# EasyEDA schematic SCH_balcony_pump_2022-12-04.json
TITLE: balcony_pump; REV: 1.0; Date: 2022-12-04; Sheet: 1/1; Drawn By: Przemysław Szyszkiewicz; Company: Your Company
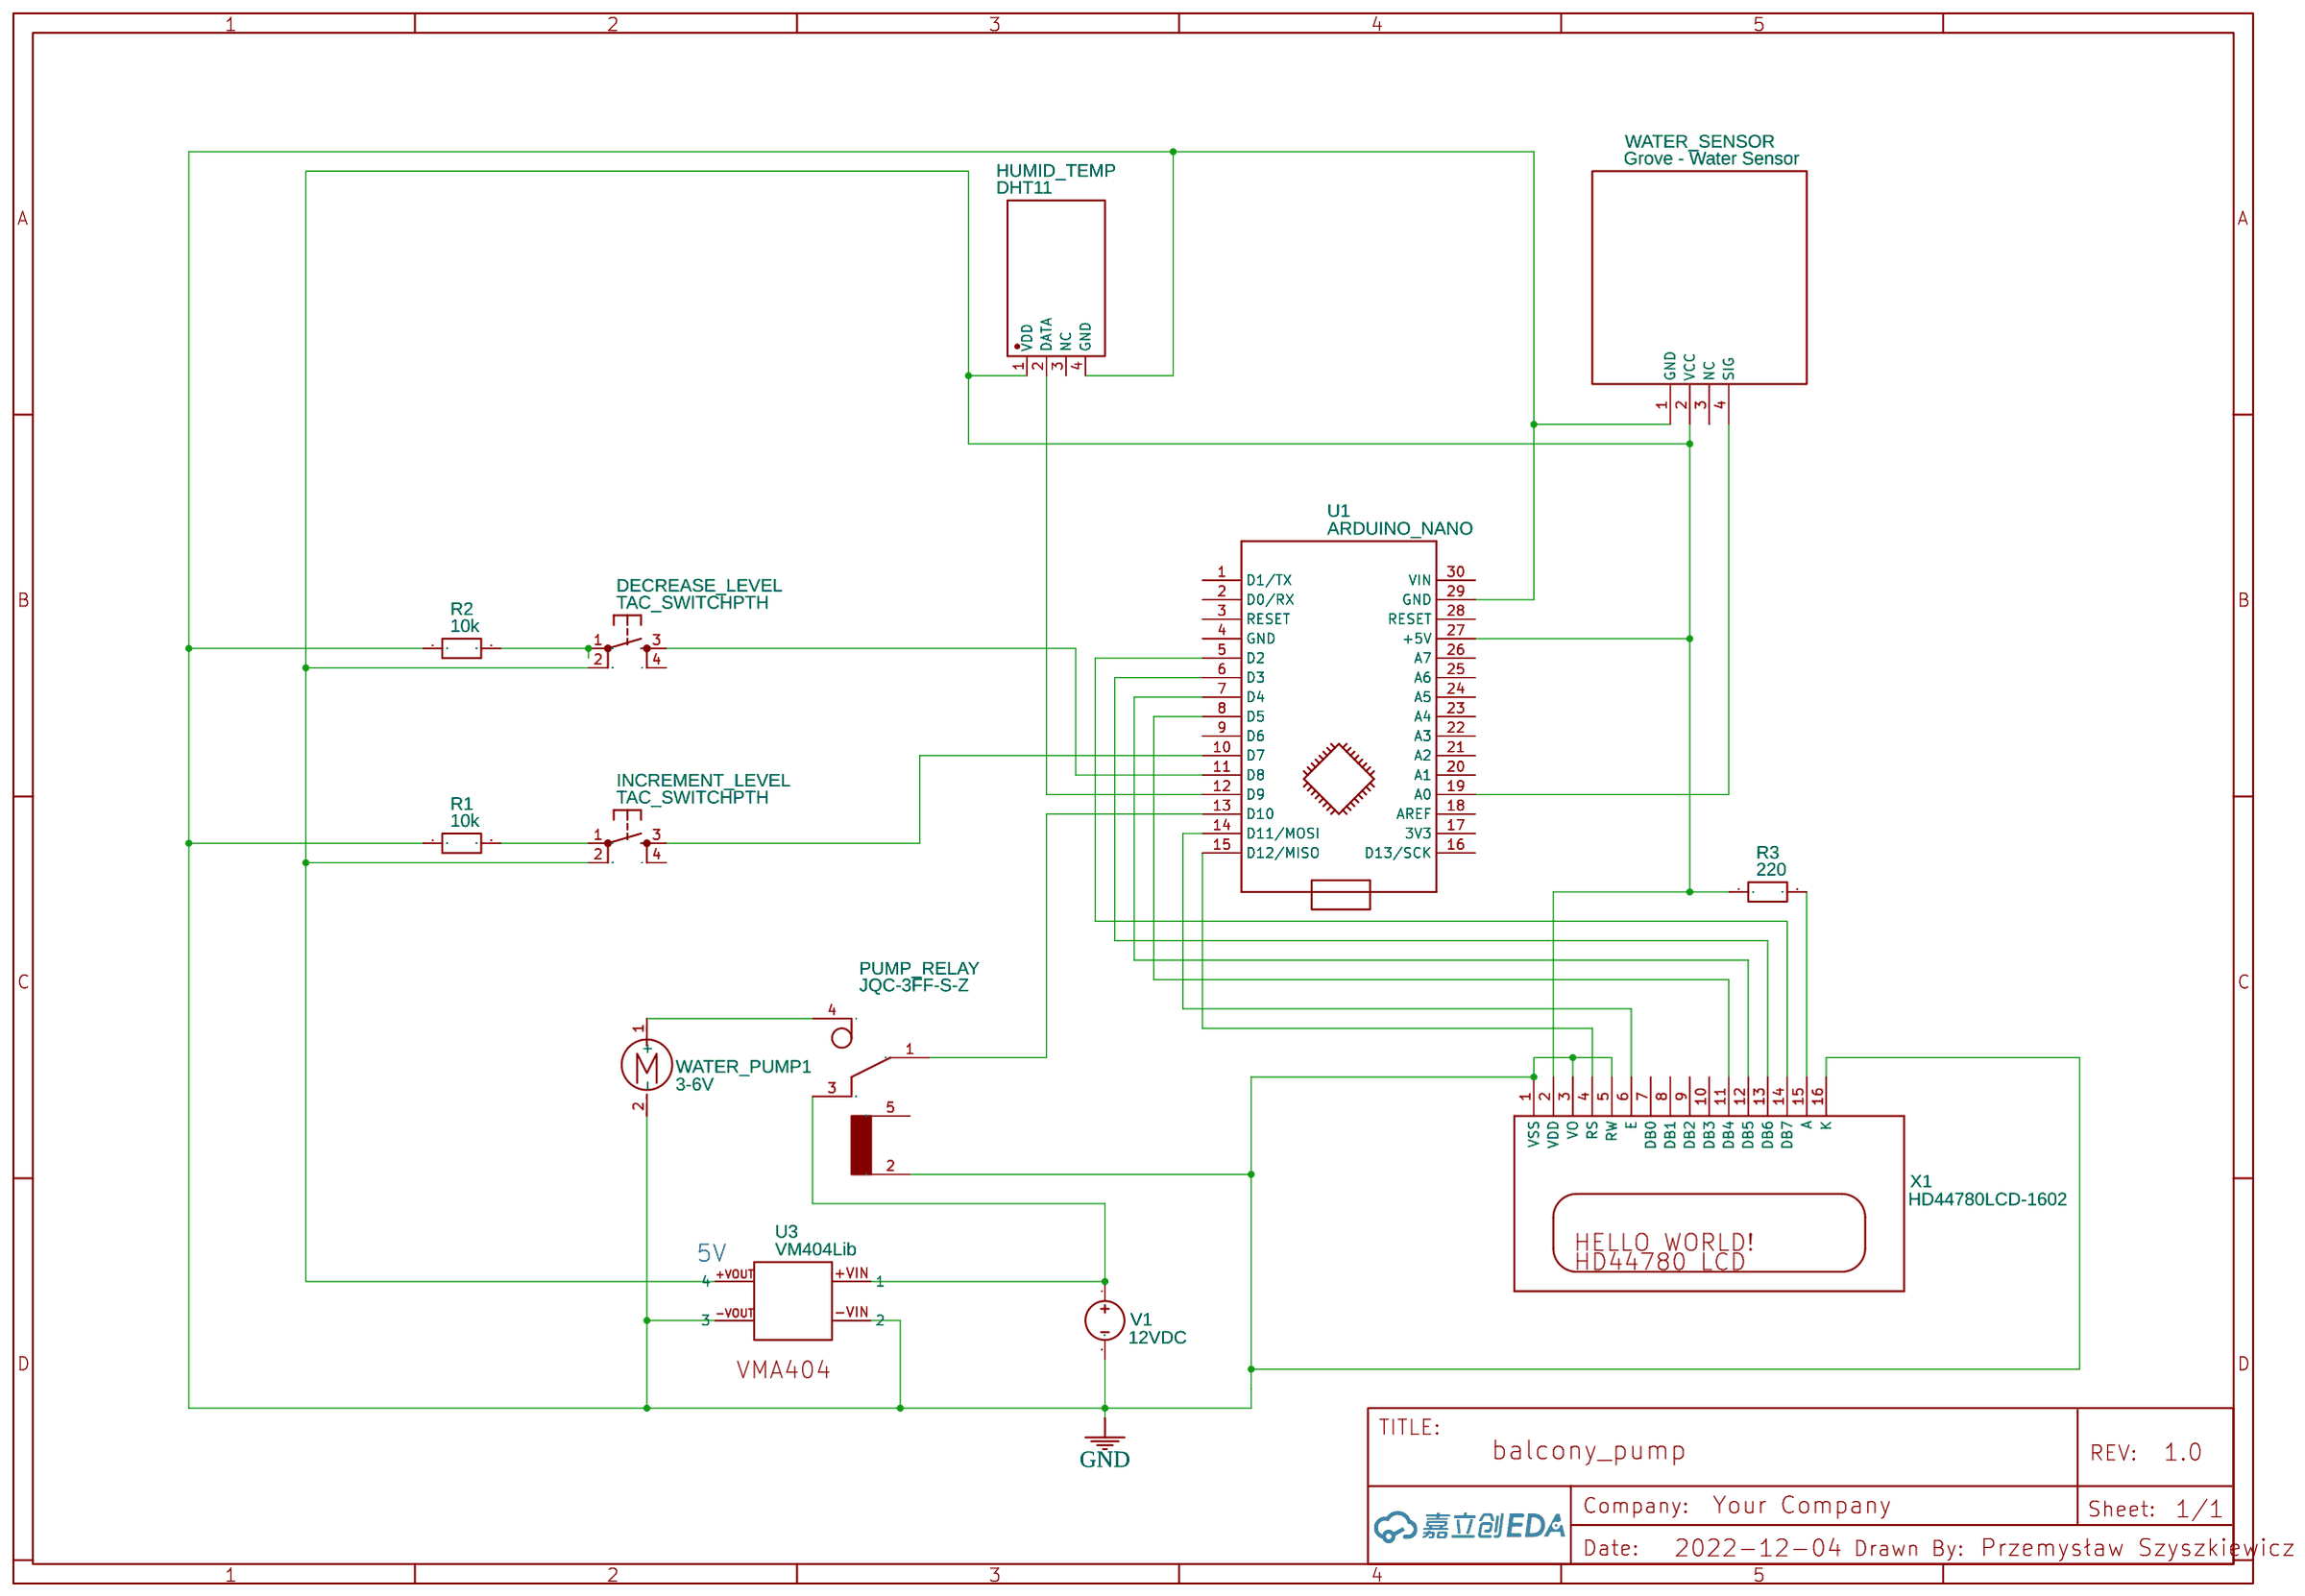
[diagram p0: schematic sheet]

## Parts
DECREASE_LEVEL  TAC_SWITCHPTH  [TACTILE-PTH]
HUMID_TEMP  DHT11  [DHT11]
INCREMENT_LEVEL  TAC_SWITCHPTH  [TACTILE-PTH]
PUMP_RELAY  JQC-3FF-S-Z  [JQC-3FF-S-Z]
R1  10k  [R0603]
R2  10k  [R0603]
R3  220  [R0603]
U1  ARDUINO_NANO  [ARDUINO_NANO]
U3  VM404Lib  [VMA404 STEP DOWN MODULE LM2596S]
V1  12VDC  [HDR1X2]
WATER_PUMP1  3-6V  [CONN-TH_2P-P5.08]
WATER_SENSOR  Grove - Water Sensor  [GROVE - WATER SENSOR]
X1  HD44780LCD-1602  [LCD1602]

## Library data of the parts
DECREASE_LEVEL INCREMENT_LEVEL = TAC_SWITCHPTH: Momentary Switch; Contributor: SparkFun
HUMID_TEMP = DHT11: Supplier: LCSC; Supplier Part: C117051; Manufacturer: Aosong (Guangzhou) Elec; Contributor: LCSC
PUMP_RELAY = JQC-3FF-S-Z: Contributor: EasyEDA; link: https://www.alibaba.com/product-detail/relay-types-JQC-3FF-S-Z_60682592473.html
R1-R3 = R_0603_EU: Contributor: LCEDA_Lib
U1 = ARDUINO_NANO: sourceId: KGSeAWhDB
U3 = VM404Lib: Manufacturer Part: New SchematicLib; Contributor: ReneSchrauwers; Supplier: Conrad; Supplier Part: 1612753; Manufacturer: Velleman
V1 = Power_Supply_12V: Contributor: Ajnevs
WATER_PUMP1 = Motor_DC: Contributor: KiCAD; license: https://www.gnu.org/licenses/lgpl-2.1.html
WATER_SENSOR = Grove - Water Sensor: sourceId: PCwqI0iAu; Supplier Part: undefined; Supplier: SeeedStudio
X1 = HD44780LCD-1602: HD44780 LCD; Contributor: Adafruit

## Nets
GND: HUMID_TEMP.4(GND) PUMP_RELAY.2 R1.1 R2.1 U1.29(GND) U3.-VIN(2) U3.-VOUT(3) V1.2 WATER_PUMP1.2(-) WATER_SENSOR.1(GND) X1.1(VSS) X1.3(VO) X1.5(RW) X1.16(K)
Net-(DECREASE_LEVEL-1): DECREASE_LEVEL.1 R2.2
Net-(DECREASE_LEVEL-2): DECREASE_LEVEL.2 HUMID_TEMP.1(VDD) INCREMENT_LEVEL.2 R3.1 U1.27(+5V) U3.+VOUT(4) WATER_SENSOR.2(VCC) X1.2(VDD)
Net-(DECREASE_LEVEL-3): DECREASE_LEVEL.3 U1.11(D8)
Net-(HUMID_TEMP-2): HUMID_TEMP.2(DATA) U1.12(D9)
Net-(INCREMENT_LEVEL-1): INCREMENT_LEVEL.1 R1.2
Net-(INCREMENT_LEVEL-3): INCREMENT_LEVEL.3 U1.10(D7)
Net-(PUMP_RELAY-1): PUMP_RELAY.1 U1.13(D10)
Net-(PUMP_RELAY-3): PUMP_RELAY.3 U3.+VIN(1) V1.1
Net-(PUMP_RELAY-4): PUMP_RELAY.4 WATER_PUMP1.1(+)
Net-(R3-2): R3.2 X1.15(A)
Net-(U1-5): U1.5(D2) X1.14(DB7)
Net-(U1-6): U1.6(D3) X1.13(DB6)
Net-(U1-7): U1.7(D4) X1.12(DB5)
Net-(U1-8): U1.8(D5) X1.11(DB4)
Net-(U1-14): U1.14(D11/MOSI) X1.6(E)
Net-(U1-15): U1.15(D12/MISO) X1.4(RS)
Net-(U1-19): U1.19(A0) WATER_SENSOR.4(SIG)

Not connected (* = marked no-connect by the designer): DECREASE_LEVEL 4; HUMID_TEMP 3(NC); INCREMENT_LEVEL 4; PUMP_RELAY 5; U1 1(D1/TX) 2(D0/RX) 3(RESET) 4(GND) 9(D6) 16(D13/SCK) 17(3V3) 18(AREF) 20(A1) 21(A2) 22(A3) 23(A4) 24(A5) 25(A6) 26(A7) 28(RESET) 30(VIN); WATER_SENSOR 3(NC); X1 7(DB0) 8(DB1) 9(DB2) 10(DB3)

## Notes on the sheet
- 5V
